# EAGLE design HR30_6R_6PD(71) - FFC (EAGLE 9.6.2)
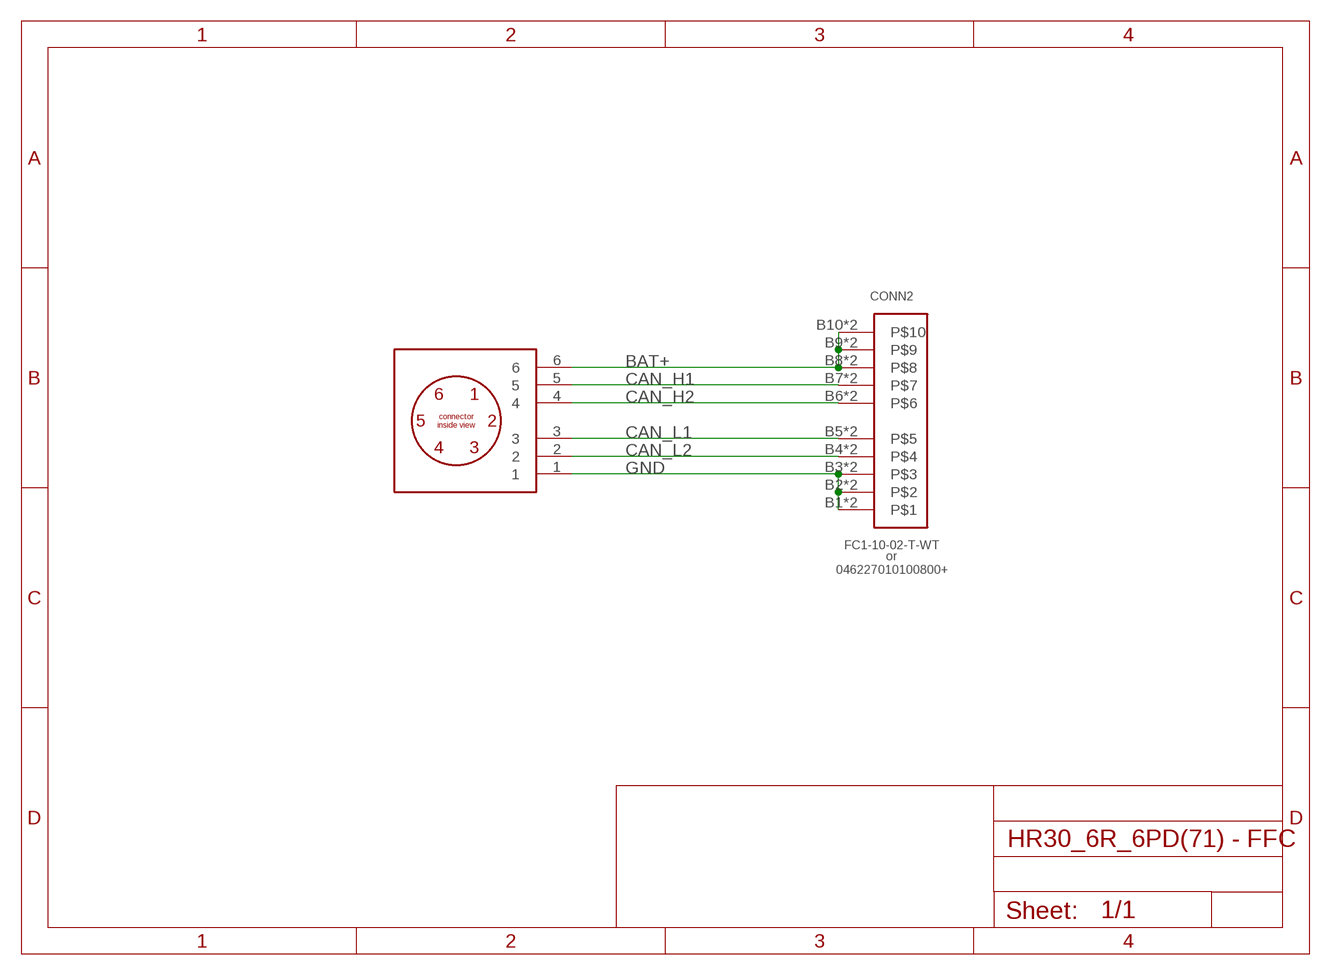
[diagram p0: schematic, sheet 1]

## Parts
CONN1  HR30-6R-6PD(71)  HR30_6R_6PD(71)_FFC  [TH]
CONN2  FC1-10-02-T-WT  FC1-10-02-T-FFC_CABLE_CONTACTS  [SMD]

## Nets
BAT+ [BAT+]: CONN1.6 CONN2.B8 CONN2.B9 CONN2.B10 CONN2.T8 CONN2.T9 CONN2.T10
CAN_H1 [signal]: CONN1.5 CONN2.B7 CONN2.T7
CAN_H2 [signal]: CONN1.4 CONN2.B6 CONN2.T6
CAN_L1 [signal]: CONN1.3 CONN2.B5 CONN2.T5
CAN_L2 [signal]: CONN1.2 CONN2.B4 CONN2.T4
GND: CONN1.1 CONN2.B1 CONN2.B2 CONN2.B3 CONN2.T1 CONN2.T2 CONN2.T3

## Notes on the sheet
- or
  046227010100800+

## Library data of the parts
CONN1 = HR30_6R_6PD(71) - Receptacle TH FFC:HR30_6R_6PD(71)_FFC
CONN2 = FC1-10-02-T  - FFC Cable Contacts:FC1-10-02-T-FFC_CABLE_CONTACTS

## Net classes
0 GND: width 0.25 mm, drill 0.35 mm, clearance 0.19 mm
1 BAT+: width 2 mm, drill 0.35 mm, clearance 0.5 mm to class 0, clearance 0.19 mm
2 signal: width 0.3 mm, drill 0.35 mm, clearance 0.19 mm to class 0, clearance 0.5 mm to class 1, clearance 0.19 mm

## Board
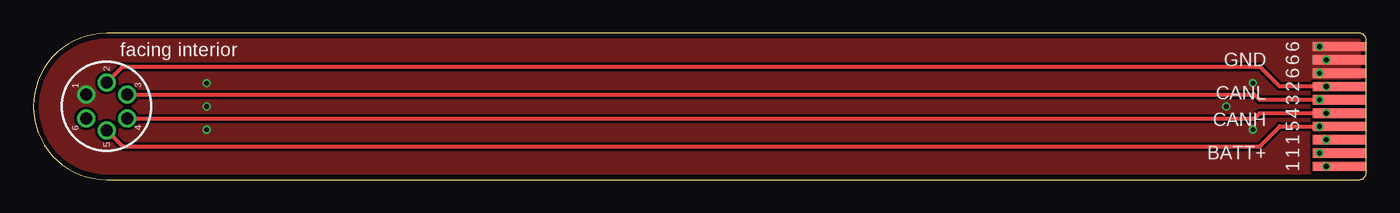
[diagram p1: board, top side]
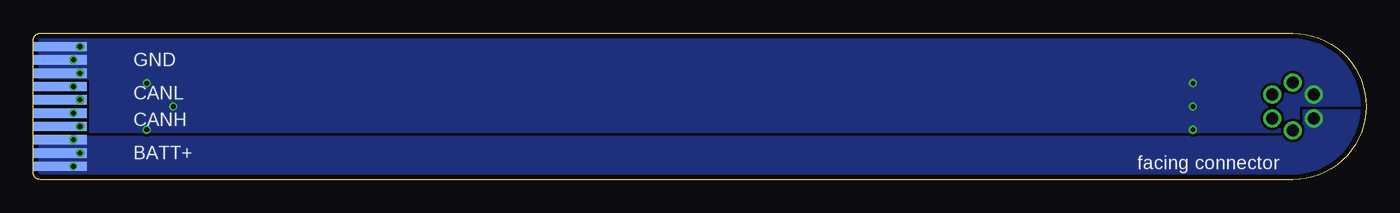
[diagram p2: board, bottom side, seen from below]

Size 100 x 11 mm. Coordinates in mm from the lower left corner, seen from the top.
Outline: 5.5,0 99.5,0 arc90 100,0.5 100,10.5 arc90 99.5,11 5.5,11 arc90 0,5.5 arc90 5.5,0
Copper layers (1*16): Top 0.035559375mm / dielectric 1.6mm / Bottom 0.035559375mm
Design rules "oshpark-2layer": minimum track width 6mil, minimum drill 10mil, track to track 6mil, track to pad 6mil, pad to pad 6mil, via to via 6mil, smd to smd 6mil, copper to edge 15mil, drill to drill 6mil, minimum pad ring 5mil, minimum via ring 5mil, stop-mask expansion 2.5mil, vias tented up to drill 0mil, thermal gap 10mil

### Footprints (pad centres in the part's own frame; a part is rotated, then mirrored left to right if it is on the bottom)
TH = drill 0.9: 1 0.9,1.55; 2 1.8,0; 3 0.9,-1.55; 4 -0.9,-1.55; 5 -1.8,0; 6 -0.9,1.55
SMD = smd 4 x 0.7 bottom: B1 0,-4.5; B2 0,-3.5; B3 0,-2.5; B4 0,-1.5; B5 0,-0.5; B6 0,0.5; B7 0,1.5; B8 0,2.5; B9 0,3.5; B10 0,4.5 | smd 4 x 0.7: T1 0,-4.5; T2 0,-3.5; T3 0,-2.5; T4 0,-1.5; T5 0,-0.5; T6 0,0.5; T7 0,1.5; T8 0,2.5; T9 0,3.5; T10 0,4.5

### Placement (x,y rotation side)
CONN1  5.5,5.5 90 top
CONN2  98,5.5 180 bottom

### Tracks (layer width: path | path; a pad name or v marks a point on that pad's centre or on a via)
BAT+  (via drill 0.35)
  Top 0.7: CONN2.T8 v97,3 | CONN2.T9 v96.5,2 | CONN2.T10 v97,1
  pour Bottom (no thermals): 100,3.25 100,-0.5 -0.25,-0.5 -0.25,3.25
  pour Bottom (no thermals): -0.25,0.25 -0.25,5.25 4.75,5.25 4.75,0.25
CAN_H1  (via drill 0.35)
  Top 0.3: CONN1.5 6.7,2.5 92,2.5 93.5,4 v96.5,4 CONN2.T7
  Bottom 0.3: CONN2.T7 v96.5,4
CAN_H2  (via drill 0.35)
  Top 0.3: CONN1.4 91.6,4.6 92,5 v97,5 CONN2.B6
  Bottom 0.3: CONN2.B6 v97,5
CAN_L1  (via drill 0.35)
  Top 0.3: CONN1.3 91.6,6.4 92,6 v96.5,6 CONN2.T5
  Bottom 0.3: CONN2.T5 v96.5,6
CAN_L2  (via drill 0.35)
  Top 0.3: CONN1.2 6.7,8.5 92,8.5 93.5,7 v97,7 CONN2.T4
  Bottom 0.3: CONN2.T4 v97,7
GND  (via drill 0.35)
  other vias: 91.5,3.75 91.5,7.25 89.5,5.5 13,5.5 13,3.75 13,7.25 96.5,8 97,9 96.5,10
  pour Top (rank 6, no thermals): -0.5,11.5 101,11.5 101,-0.5 -0.5,-0.5
  pour Bottom (rank 6, no thermals): -0.5,11.5 101,11.5 101,-0.5 -0.5,-0.5

### Text on the board
tPlace: facing interior | GND | 6 | 6 | 2 | 6 | CANL | 3 | 4 | CANH | 1 | 5 | BATT+ | 1 | 1
bPlace: GND | CANL | CANH | facing connector | BATT+